# Altium schematic sheet P01 Note & Title.SchDoc
size 297 x 209 mm
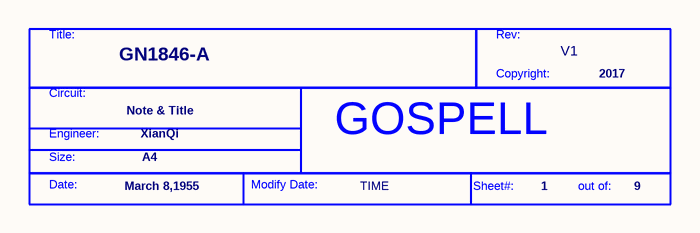
[diagram p0: P01 Note & Title.SchDoc]

## Parts
*  Doc: Note & Title  Page Count: 9  Page Number: 1  Page Create Date: March 8,1955  Page Size: A4  RevCode: V1  Title: GN1846-A  Copyright: 2017  Engineer: XianQi  Page Modify Date: TIME  (hidden comment: GOSPELL)  (graphical)

## Notes on the sheet
- (in symbol GOSPELL) Title:; Rev:; Copyright:; Circuit:; Engineer:; Size:; Date:; Modify Date:; Sheet#:; out of:

## Library data of the parts
* = GOSPELL: Cage Code: 2017; Schematic Page Count: 9; Schematic Page Number: 1